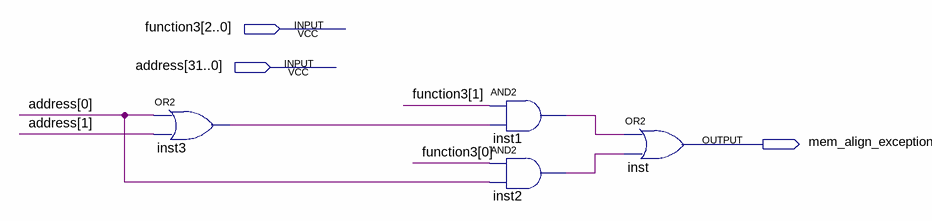
[diagram p0: schematic sheet]
// Quartus schematic MemAlignExceptionCheck.bdf as structural Verilog: 4 symbols, 3 pins
module MemAlignExceptionCheck (
  input  [2:0] function3,
  input  [31:0] address,
  output mem_align_exception
);

  wire inst1_out, inst2_out, inst3_out;

  or inst3 (inst3_out, address[0], address[1]);
  and inst1 (inst1_out, function3[1], inst3_out);
  and inst2 (inst2_out, function3[0], address[0]);
  or inst (mem_align_exception, inst1_out, inst2_out);
endmodule
